# EAGLE board fpga (EAGLE 4.16), part 1 of 2
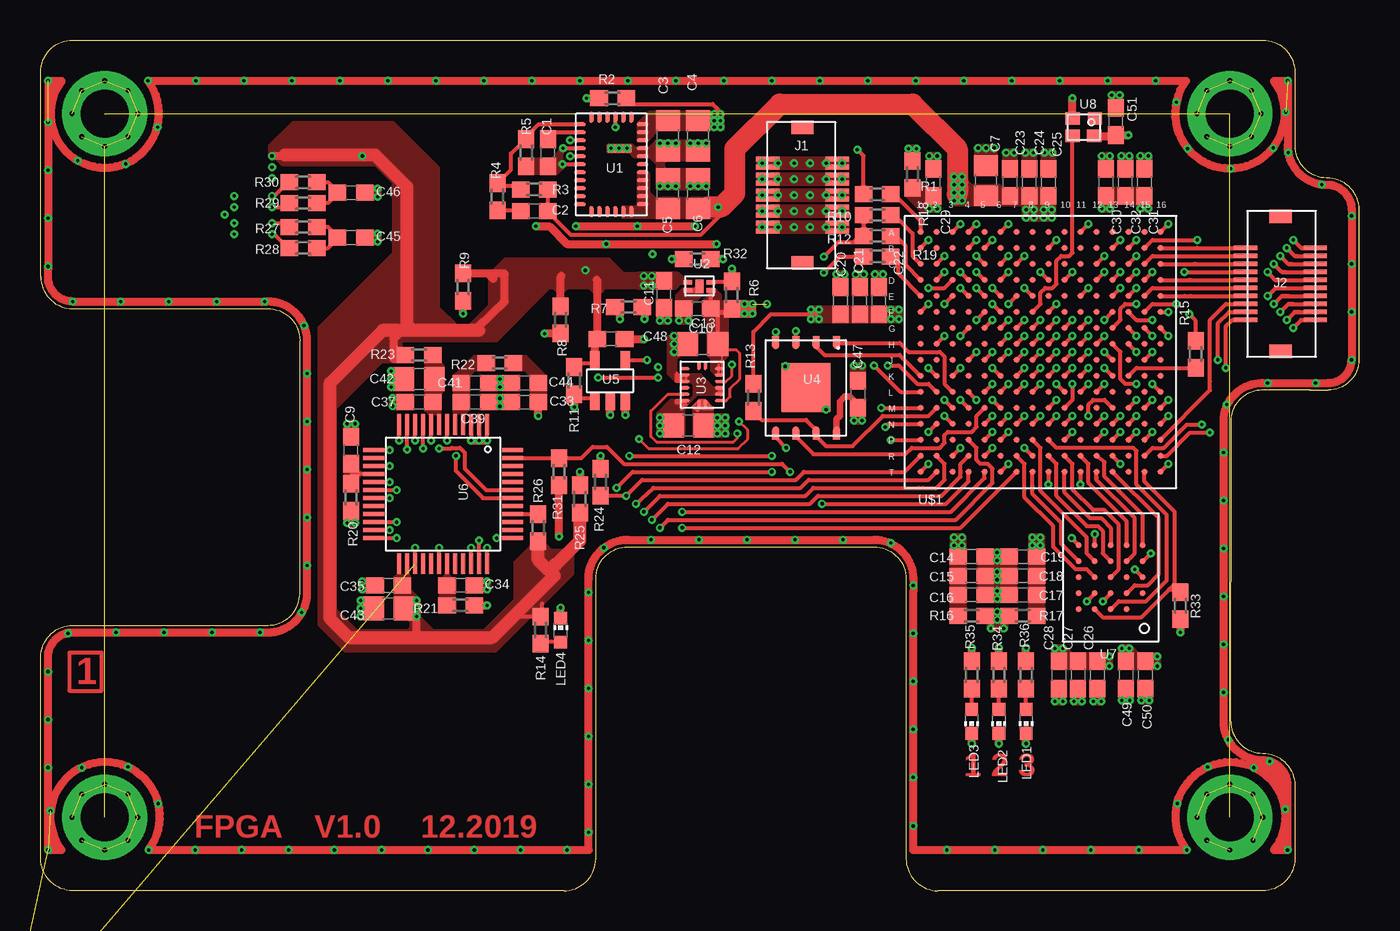
[diagram p2: board, top side]
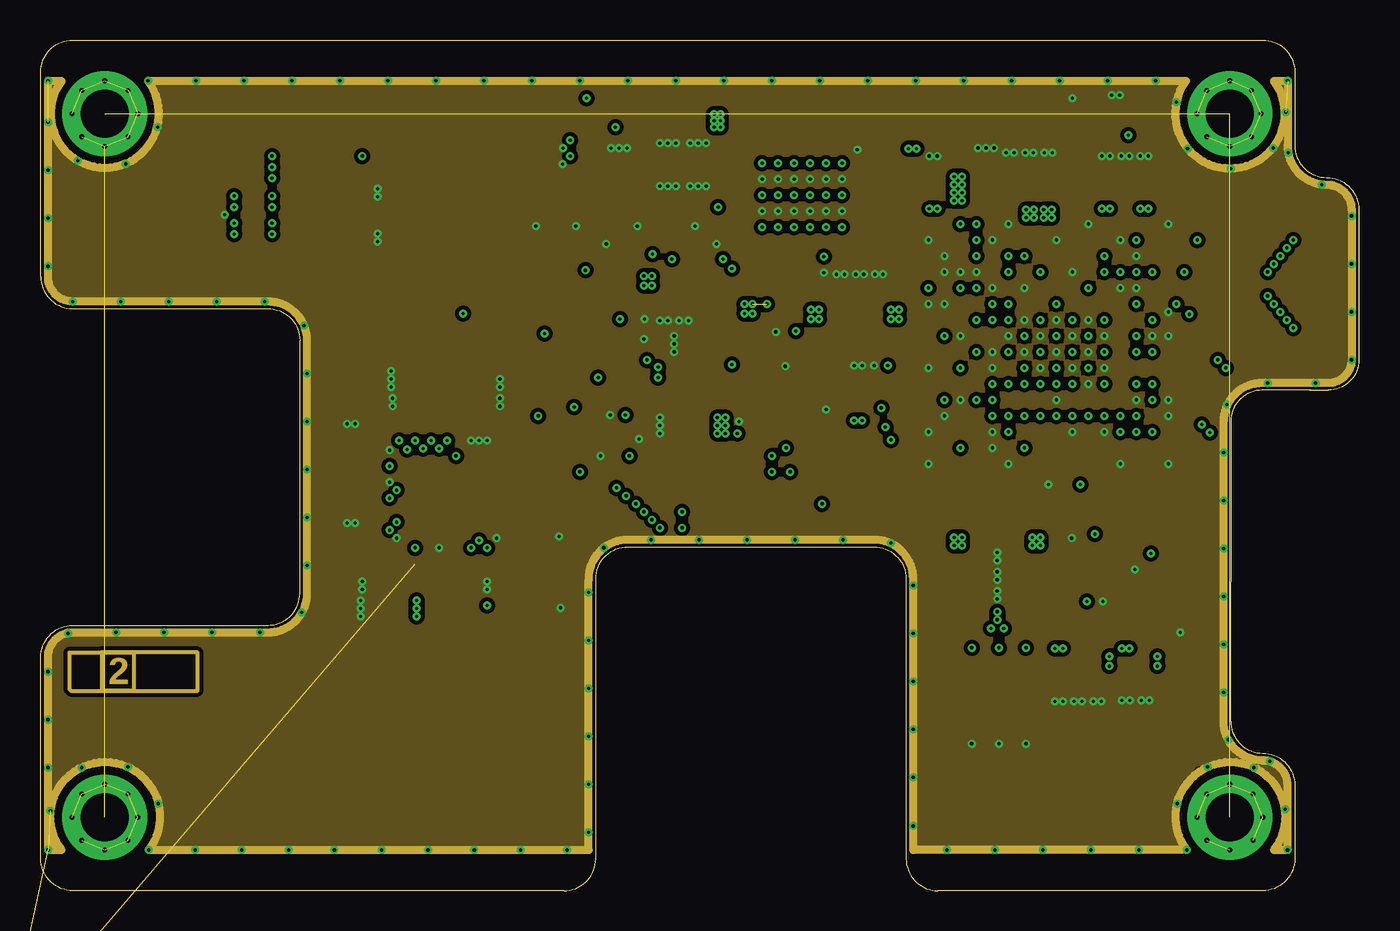
[diagram p3: board, inner layer Route2]
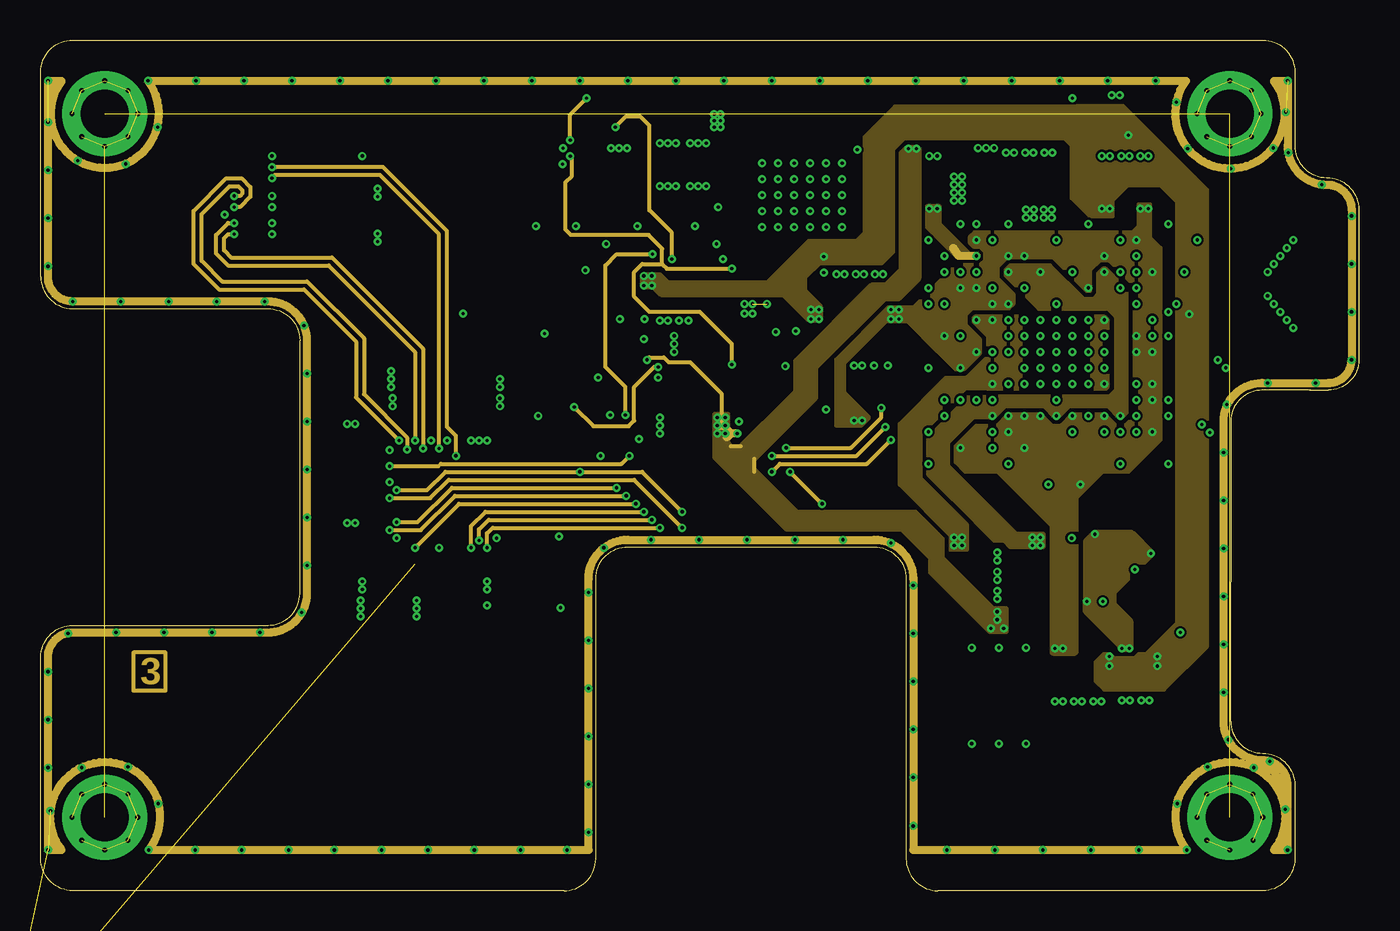
[diagram p4: board, inner layer Route15]
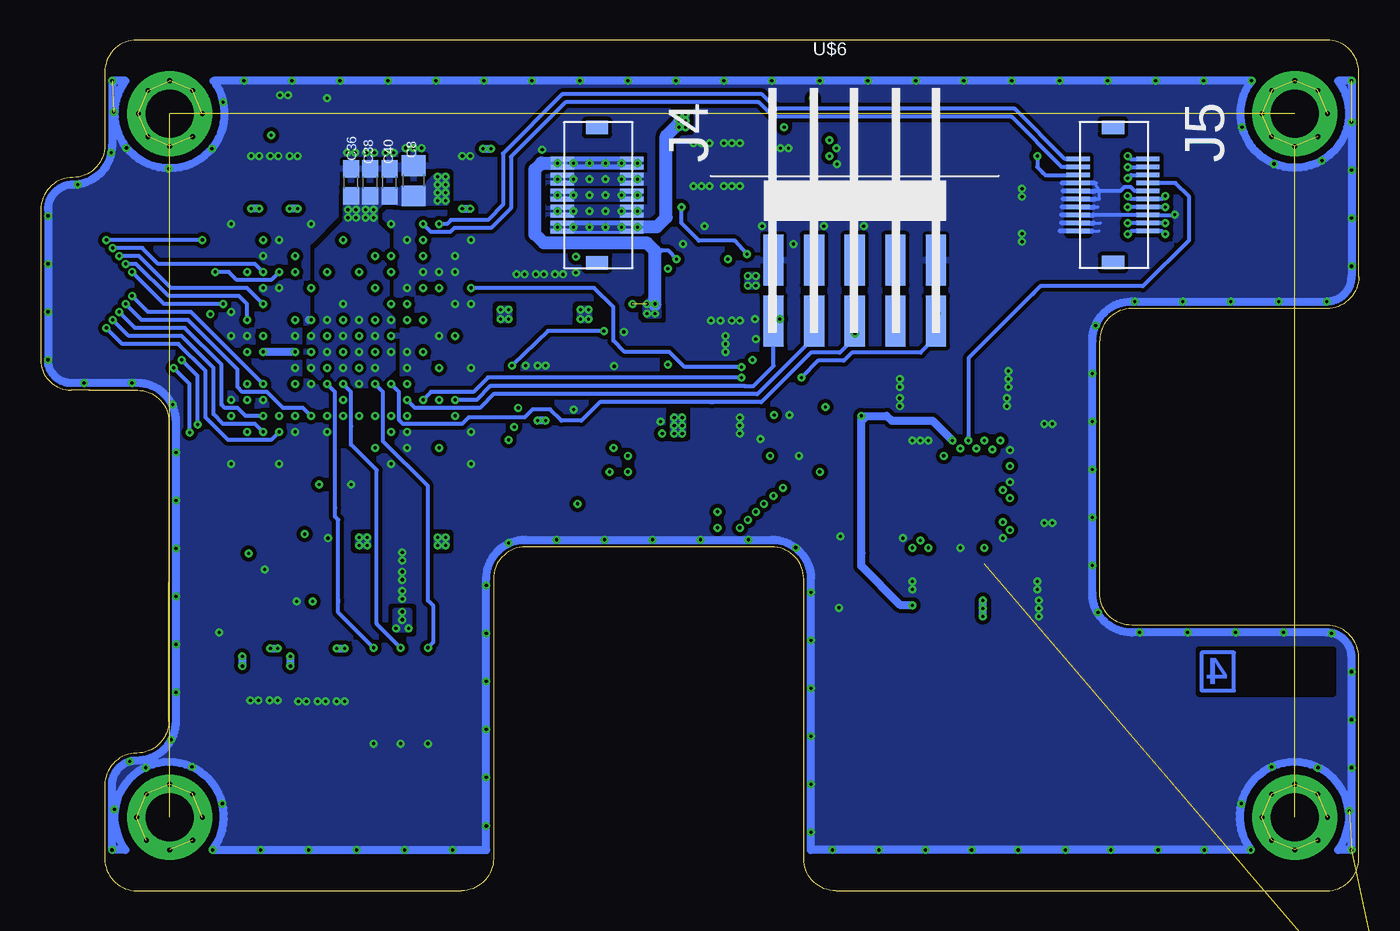
[diagram p5: board, bottom side, seen from below]

Size 82.4 x 53.2 mm. Coordinates in mm from the lower left corner, seen from the top.
Outline: 76.4,8.6 arc-90 78.4,6.6 78.4,2 arc-90 76.4,0 56.1,0 arc-90 54.1,2 54.1,19.5 arc90 52.1,21.5 36.7,21.5 arc90 34.7,19.5 34.7,2 arc-90 32.7,0 2,0 arc-90 0,2 0,14.6 arc-90 2,16.6 14.2,16.6 arc90 16.2,18.6 16.2,34.4 arc90 14.2,36.4 2,36.4 arc-90 0,38.4 0,51.2 arc-90 2,53.2 43,53.2 76.4,53.2 arc-90 78.4,51.2 78.4,46.6 arc90 80.4,44.6 arc-90 82.4,42.6 82.4,33.2 arc-90 80.5,31.3 79.4,31.3
Outline: 76.4,8.6 arc-90 74.4,10.6 74.4,19.3 74.4,29.35 arc-90 76.35,31.3 79.4,31.3
Outline: 76.4,8.6 76.4,8.6
Outline: 79.35,31.3 79.4,31.3
Copper layers (1+2*15+16): Top 0.035mm / dielectric 0.1mm / Route2 0.035mm / dielectric 1.3mm / Route15 0.035mm / dielectric 0.1mm / Bottom 0.035mm
Design rules "default": minimum track width 10mil, minimum drill 0.2mm, track to track 5mil, track to pad 5mil, pad to pad 5mil, via to via 5mil, smd to smd 0mil, copper to edge 12mil, drill to drill 8mil, minimum pad ring 10mil, minimum via ring 4mil, stop-mask expansion 3mil, vias tented up to drill 20mil, thermal gap 0.2mm
tKeepout: area 2.2,9.1 to 5,13.5
bKeepout: area 1.7,12.3 to 9.9,15
tRestrict: area 2.2,9.1 to 5,13.5; area 71.7,2.1 to 73.1,4.7; area 5.5,2 to 6.7,4.8; area 71.7,48.6 to 73.1,51.4; area 5.7,48.6 to 6.7,51.2; area 1.4,48.6 to 2.3,51.2; area 76,48.6 to 77,51.4; area 75.8,2.1 to 77,4.6; area 1.3,1.4 to 2.6,4.6
bRestrict: area 16.9,41 to 17.5,44.6; area 71.7,2.1 to 73.1,4.7; area 76.1,2.1 to 77,4.6; area 17.6,41 to 18.1,44.6; area 1.7,12.3 to 9.9,15

## Footprints (pad centres in the part's own frame; a part is rotated, then mirrored left to right if it is on the bottom)
C0603 = smd 1.1 x 1: 1 -0.85,0; 2 0.85,0
C0805 = smd 1.3 x 1.5: 1 -0.95,0; 2 0.95,0
CON = smd 0.3 x 1.45: 1 -3,0.5; 2 -2.5,0.5; 3 -2,0.5; 4 -1.5,0.5; 5 -1,0.5; 6 -0.5,0.5; 7 0,0.5; 8 0.5,0.5; 9 1,0.5; 10 1.5,0.5; 11 1.5,4.85; 12 1,4.85; 13 0.5,4.85; 14 0,4.85; 15 -0.5,4.85; 16 -1,4.85; 17 -1.5,4.85; 18 -2,4.85; 19 -2.5,4.85; 20 -3,4.85 | smd 0.85 x 1.4: P$1 -4.975,2.675; P$2 3.475,2.675
CHIP-LED0603 = smd 0.8 x 0.8: A 0,-0.75; C 0,0.75
R0603 = smd 1.1 x 1: 1 -0.85,0; 2 0.85,0
EN6340QI = smd 0.25 x 0.7: 1 3.25,-3.45; 2 3.75,-3.45; 3 4.25,-3.45; 4 4.75,-3.45; 5 5.25,-3.45; 6 5.75,-3.45; 18 5.75,2.45; 19 5.25,2.45; 20 4.75,2.45; 21 4.25,2.45; 22 3.75,2.45; 23 3.25,2.45 | smd 0.7 x 0.25: 7 6.45,-3; 8 6.45,-2.5; 9 6.45,-2; 10 6.45,-1.5; 11 6.45,-1; 12 6.45,-0.5; 13 6.45,0; 14 6.45,0.5; 15 6.45,1; 16 6.45,1.5; 17 6.45,2; 24 2.55,2; 25 2.55,1.5; 26 2.55,1; 27 2.55,0.5; 28 2.55,0; 29 2.55,-0.5; 30 2.55,-1; 31 2.55,-1.5; 32 2.55,-2; 33 2.55,-2.5; 34 2.55,-3 | smd 0.2 x 0.25: P$4 2.4,0.5 | smd 1.55 x 0.53: PGND 5.025,0.49
SIP32431 = smd 0.3 x 0.55: 1 -0.5,-0.45; 2 0,-0.45; 3 0,1; 4 -0.5,1 | smd 0.86 x 0.5: PAD -0.25,0.275
EP5358HUI = smd 0.55 x 0.2: 1 -1.2,0.8; 2 -1.2,0.4; 3 -1.2,0; 4 -1.2,-0.4; 5 -1.2,-0.8; 6 -1.2,-1.2; 9 0.9,-1.2; 10 0.9,-0.8; 11 0.9,-0.4; 12 0.9,0; 13 0.9,0.4; 14 0.9,0.8 | smd 0.2 x 0.55: 7 -0.35,-1.375; 8 0.05,-1.375; 15 0.05,0.975; 16 -0.35,0.975 | smd 0.2 x 0.2: P$1 -0.35,-1.55; P$2 0.05,-1.55; P$3 -0.35,1.15; P$4 0.05,1.15; P$5 -1.375,0.8; P$6 -1.375,0.4; P$7 -1.375,0; P$8 -1.375,-0.4; P$9 -1.375,-0.8; P$10 -1.375,-1.2; P$11 1.075,-1.2; P$12 1.075,-0.8; P$13 1.075,-0.4; P$14 1.075,0; P$15 1.075,0.4; P$16 1.075,0.8
MT25Q128AB = smd 0.8 x 0.45: 1 1.27,2.54; 2 1.27,1.27; 3 1.27,0; 4 1.27,-1.27; 5 6.875,-1.27; 6 6.875,0; 7 6.875,1.27; 8 6.875,2.54 | smd 0.45 x 0.45: P$1 1.075,2.54; P$2 1.075,1.27; P$3 1.075,0; P$4 1.075,-1.27; P$5 7.07,-1.27; P$6 7.07,0; P$7 7.07,1.27; P$8 7.07,2.54 | smd 3.1 x 3.1: PAD 4.06,0.62
SOT-23-5 = smd 0.6 x 1.1: 1 -1,-1.3; 2 -0.05,-1.3; 3 0.9,-1.3; 4 0.9,1.3; 5 -1,1.3
48TQFP = smd 1.3 x 0.25: 1 -4.4,2.85; 2 -4.4,2.35; 3 -4.4,1.85; 4 -4.4,1.35; 5 -4.4,0.85; 6 -4.4,0.35; 7 -4.4,-0.15; 8 -4.4,-0.65; 9 -4.4,-1.15; 10 -4.4,-1.65; 11 -4.4,-2.15; 12 -4.4,-2.65; 25 4.3,-2.65; 26 4.3,-2.15; 27 4.3,-1.65; 28 4.3,-1.15; 29 4.3,-0.65; 30 4.3,-0.15; 31 4.3,0.35; 32 4.3,0.85; 33 4.3,1.35; 34 4.3,1.85; 35 4.3,2.35; 36 4.3,2.85 | smd 0.25 x 1.3: 13 -2.8,-4.25; 14 -2.3,-4.25; 15 -1.8,-4.25; 16 -1.3,-4.25; 17 -0.8,-4.25; 18 -0.3,-4.25; 19 0.2,-4.25; 20 0.7,-4.25; 21 1.2,-4.25; 22 1.7,-4.25; 23 2.2,-4.25; 24 2.7,-4.25; 37 2.7,4.45; 38 2.2,4.45; 39 1.7,4.45; 40 1.2,4.45; 41 0.7,4.45; 42 0.2,4.45; 43 -0.3,4.45; 44 -0.8,4.45; 45 -1.3,4.45; 46 -1.8,4.45; 47 -2.3,4.45; 48 -2.8,4.45
24FBGA = smd 0.38 x 0.38: A2 -2,-1; A3 -2,0; A4 -2,1; A5 -2,2; B1 -1,-2; B2 -1,-1; B3 -1,0; B4 -1,1; B5 -1,2; C1 0,-2; C2 0,-1; C3 0,0; C4 0,1; C5 0,2; D1 1,-2; D2 1,-1; D3 1,0; D4 1,1; D5 1,2; E1 2,-2; E2 2,-1; E3 2,0; E4 2,1; E5 2,2
OSC = smd 0.9 x 0.8: 1 -0.7,-0.55; 2 0.7,-0.55; 3 0.7,0.55; 4 -0.65,0.55
256FBGA = smd 0.38 x 0.38: A1 0,15; A2 1,15; A3 2,15; A4 3,15; A5 4,15; A6 5,15; A7 6,15; A8 7,15; A9 8,15; A10 9,15; A11 10,15; A12 11,15; A13 12,15; A14 13,15; A15 14,15; A16 15,15; B1 0,14; B2 1,14; B3 2,14; B4 3,14; B5 4,14; B6 5,14; B7 6,14; B8 7,14; B9 8,14; B10 9,14; B11 10,14; B12 11,14; B13 12,14; B14 13,14; B15 14,14; B16 15,14; C1 0,13; C2 1,13; C3 2,13; C4 3,13; C5 4,13; C6 5,13; C7 6,13; C8 7,13; C9 8,13; C10 9,13; C11 10,13; C12 11,13; C13 12,13; C14 13,13; C15 14,13; C16 15,13; D1 0,12; D2 1,12; D3 2,12; D4 3,12; D5 4,12; D6 5,12; D7 6,12; D8 7,12; D9 8,12; D10 9,12; D11 10,12; D12 11,12; D13 12,12; D14 13,12; D15 14,12; D16 15,12; E1 0,11; E2 1,11; E3 2,11; E4 3,11; E5 4,11; E6 5,11; E7 6,11; E8 7,11; E9 8,11; E10 9,11; E11 10,11; E12 11,11; E13 12,11; E14 13,11; E15 14,11; E16 15,11; F1 0,10; F2 1,10; F3 2,10; F4 3,10; F5 4,10; F6 5,10; F7 6,10; F8 7,10; F9 8,10; F10 9,10; F11 10,10; F12 11,10; F13 12,10; F14 13,10; F15 14,10; F16 15,10; G1 0,9; G2 1,9; G3 2,9; G4 3,9; G5 4,9; G6 5,9; G7 6,9; G8 7,9; G9 8,9; G10 9,9; G11 10,9; G12 11,9; G13 12,9; G14 13,9; G15 14,9; G16 15,9; H1 0,8; H2 1,8; H3 2,8; H4 3,8; H5 4,8; H6 5,8; H7 6,8; H8 7,8; H9 8,8; H10 9,8; H11 10,8; H12 11,8; H13 12,8; H14 13,8; H15 14,8; H16 15,8; J1 0,7; J2 1,7; J3 2,7; J4 3,7; J5 4,7; J6 5,7; J7 6,7; J8 7,7; J9 8,7; J10 9,7; J11 10,7; J12 11,7; J13 12,7; J14 13,7; J15 14,7; J16 15,7; K1 0,6; K2 1,6; K3 2,6; K4 3,6; K5 4,6; K6 5,6; K7 6,6; K8 7,6; K9 8,6; K10 9,6; K11 10,6; K12 11,6; K13 12,6; K14 13,6; K15 14,6; K16 15,6; L1 0,5; L2 1,5; L3 2,5; L4 3,5; L5 4,5; L6 5,5; L7 6,5; L8 7,5; L9 8,5; L10 9,5; L11 10,5; L12 11,5; L13 12,5; L14 13,5; L15 14,5; L16 15,5; M1 0,4; M2 1,4; M3 2,4; M4 3,4; M5 4,4; M6 5,4; M7 6,4; M8 7,4; M9 8,4; M10 9,4; M11 10,4; M12 11,4; M13 12,4; M14 13,4; M15 14,4; M16 15,4; N1 0,3; N2 1,3; N3 2,3; N4 3,3; N5 4,3; N6 5,3; N7 6,3; N8 7,3; N9 8,3; N10 9,3; N11 10,3; N12 11,3; N13 12,3; N14 13,3; N15 14,3; N16 15,3; P1 0,2; P2 1,2; P3 2,2; P4 3,2; P5 4,2; P6 5,2; P7 6,2; P8 7,2; P9 8,2; P10 9,2; P11 10,2; P12 11,2; P13 12,2; P14 13,2; P15 14,2; P16 15,2; R1 0,1; R2 1,1; R3 2,1; R4 3,1; R5 4,1; R6 5,1; R7 6,1; R8 7,1; R9 8,1; R10 9,1; R11 10,1; R12 11,1; R13 12,1; R14 13,1; R15 14,1; R16 15,1; T1 0,0; T2 1,0; T3 2,0; T4 3,0; T5 4,0; T6 5,0; T7 6,0; T8 7,0; T9 8,0; T10 9,0; T11 10,0; T12 11,0; T13 12,0; T14 13,0; T15 14,0; T16 15,0
MOUNT = drill 3 pad 5.3 round: P$1 0,0
HEADER_10_H = smd 1.27 x 3.175: 1 1.27,11.43; 2 1.27,7.62; 3 -1.27,11.43; 4 -1.27,7.62; 5 -3.81,11.43; 6 -3.81,7.62; 7 -6.35,11.43; 8 -6.35,7.62; 9 -8.89,11.43; 10 -8.89,7.62

## Placement (x,y rotation side)
C1  15n  [C0603]  31.7,46.15 270 top
C2  15p  [C0603]  30.85,42.5 180 top
C3  22u  [C0805]  39.2,47.2 270 top
C4  22u  [C0805]  41.1,47.2 270 top
C5  47u  [C0805]  39.2,43.6 90 top
C6  47u  [C0805]  41.1,43.6 90 top
C7  47u  [C0805]  59.1,44.4 90 top
C8  47u  [C0805]  59.1,44.4 90 bottom
C9  100p  [C0603]  19.4,27.55 90 top
C10  1u  [C0603]  41.05,36.4 180 top
C11  100n  [C0603]  38.95,37.3 270 top
C12  22u  [C0805]  40.5,29.1 180 top
C13  22u  [C0805]  41.4,34.2 180 top
C14  10n  [C0603]  58.2,20.9 0 top
C15  100n  [C0603]  58.2,19.7 0 top
C16  1u  [C0603]  58.2,18.5 0 top
C17  1u  [C0603]  61.4,18.5 180 top
C18  100n  [C0603]  61.4,19.7 180 top
C19  10n  [C0603]  61.4,20.9 180 top
C20  1u  [C0603]  50,36.9 90 top
C21  100n  [C0603]  51.2,36.9 90 top
C22  10n  [C0603]  52.4,36.9 90 top
C23  1u  [C0603]  60.6,44.3 90 top
C24  100n  [C0603]  61.8,44.3 90 top
C25  10n  [C0603]  63,44.3 90 top
C26  1u  [C0603]  66.05,13.5 270 top
C27  100n  [C0603]  64.85,13.5 270 top
C28  10n  [C0603]  63.65,13.5 270 top
C29  100n  [C0603]  55.8,44.3 90 top
C30  1u  [C0603]  66.6,44.3 90 top
C31  10n  [C0603]  69,44.3 90 top
C32  100n  [C0603]  67.8,44.3 90 top
C33  100n  [C0603]  30.25,30.55 180 top
C34  100n  [C0603]  26.25,19.1 0 top
C35  100n  [C0603]  21.75,19.1 180 top
C36  10n  [C0603]  63,44.3 90 bottom
C37  100n  [C0603]  23.65,30.55 0 top
C38  100n  [C0603]  61.8,44.3 90 bottom
C39  100n  [C0603]  27.15,30.55 0 top
C40  1u  [C0603]  60.6,44.3 90 bottom
C41  100n  [C0603]  27.15,31.75 0 top
C42  47u  [C0805]  23.65,32 0 top
C43  47u  [C0805]  21.75,17.65 180 top
C44  1u  [C0603]  30.25,31.75 180 top
C45  100n  [C0603]  19.4,40.85 180 top
C46  100n  [C0603]  19.4,43.65 180 top
C47  100n  [C0603]  51.1,31.05 90 top
C48  100n  [C0603]  35.65,34.5 0 top
C49  100n  [C0603]  67.85,13.5 270 top
C50  1u  [C0603]  69.05,13.5 270 top
C51  100n  [C0603]  67.2,48.1 90 top
J1  JMD-20  [CON]  50.3,44.25 90 top
J2  JMD-20  [CON]  74.83,37.2 270 top
J4  JMD-20  [CON]  50.3,42.75 270 bottom
J5  JMD-20  [CON]  18.04,42.76 270 bottom
LED1  [CHIP-LED0603]  61.6,10.6 180 top
LED2  [CHIP-LED0603]  59.9,10.6 180 top
LED3  [CHIP-LED0603]  58.2,10.6 180 top
LED4  [CHIP-LED0603]  32.5,16.3 0 top
R1  2.0k  [R0603]  52.29,43.55 0 top
R2  10  [R0603]  35.75,49.55 0 top
R3  249k  [R0603]  30.85,43.85 0 top
R4  10k  [R0603]  28.55,43.4 270 top
R5  300k  [R0603]  30.35,46.15 90 top
R6  1k  [R0603]  43.2,37.25 270 top
R7  1k  [R0603]  36.75,36.5 180 top
R8  10k  [R0603]  32.5,35.7 90 top
R9  10k  [R0603]  26.4,37.75 90 top
R10  10k  [R0603]  52.3,42.25 180 top
R11  10k  [R0603]  33.35,31.9 90 top
R12  10k  [R0603]  52.3,40.95 180 top
R13  10k  [R0603]  44.56,30.85 90 top
R14  560  [R0603]  31.25,16.3 90 top
R15  10k  [R0603]  72.2,33.55 90 top
R16  FERRIT  [R0603]  58.2,17.2 180 top
R17  FERRIT  [R0603]  61.4,17.2 0 top
R18  FERRIT  [R0603]  54.5,44.8 90 top
R19  10k  [R0603]  52.3,39.66 0 top
R20  6.49k  [R0603]  19.4,24.6 90 top
R21  FERRIT  [R0603]  26.25,17.85 180 top
R22  FERRIT  [R0603]  28.7,33 0 top
R23  FERRIT  [R0603]  23.65,33.5 0 top
R24  2k  [R0603]  35,25.55 270 top
R25  4.7k  [R0603]  33.7,24.5 270 top
R26  10k  [R0603]  31.1,22.7 270 top
R27  49.9  [R0603]  16.4,41.5 0 top
R28  49.9  [R0603]  16.4,40.2 0 top
R29  49.9  [R0603]  16.4,43 0 top
R30  49.9  [R0603]  16.4,44.3 0 top
R31  2k  [R0603]  32.4,26.2 90 top
R32  10k  [R0603]  41.05,39.5 0 top
R33  10k  [R0603]  71.25,17.82 90 top
R34  560  [R0603]  59.9,13.5 90 top
R35  560  [R0603]  58.2,13.5 90 top
R36  560  [R0603]  61.6,13.5 90 top
R37  2k  [R0603]  -0.73,-6.75 0 top  (outside the outline)
U1  EN6340QI  [EN6340QI]  31.17,45.92 0 top
U2  SIP32431  [SIP32431]  40.9,37.55 270 top
U3  EP5358HUI  [EP5358HUI]  41.5,31.85 0 top
U4  MT25QL128ABA1EW7  [MT25Q128AB]  47.21,35.52 270 top
U5  LTC1728-2.5  [SOT-23-5]  35.65,31.9 0 top
U6  KSZ8041TL  [48TQFP]  25.05,24.75 270 top
U7  S27KL0641  [24FBGA]  66.9,19.6 90 top
U8  50MHz  [OSC]  65.2,47.75 180 top
U$1  5CEBA2F17C8N  [256FBGA]  55,26.2 0 top
U$3  MOUNT  [MOUNT]  74.35,48.6 0 top
U$4  MOUNT  [MOUNT]  74.35,4.6 0 top
U$6  CON_JTAG  [HEADER_10_H]  27.7,28 0 bottom
U$7  MOUNT  [MOUNT]  4,48.6 0 top
U$11  MOUNT  [MOUNT]  4,4.6 0 top